# Altium schematic sheet MicroController.SchDoc: Teknofest Project
size 381 x 241 mm; Date: 21/12/2023; SheetNumber: 2; SheetTotal: 4; Prepared by: Mustafa Oğuz Ateş
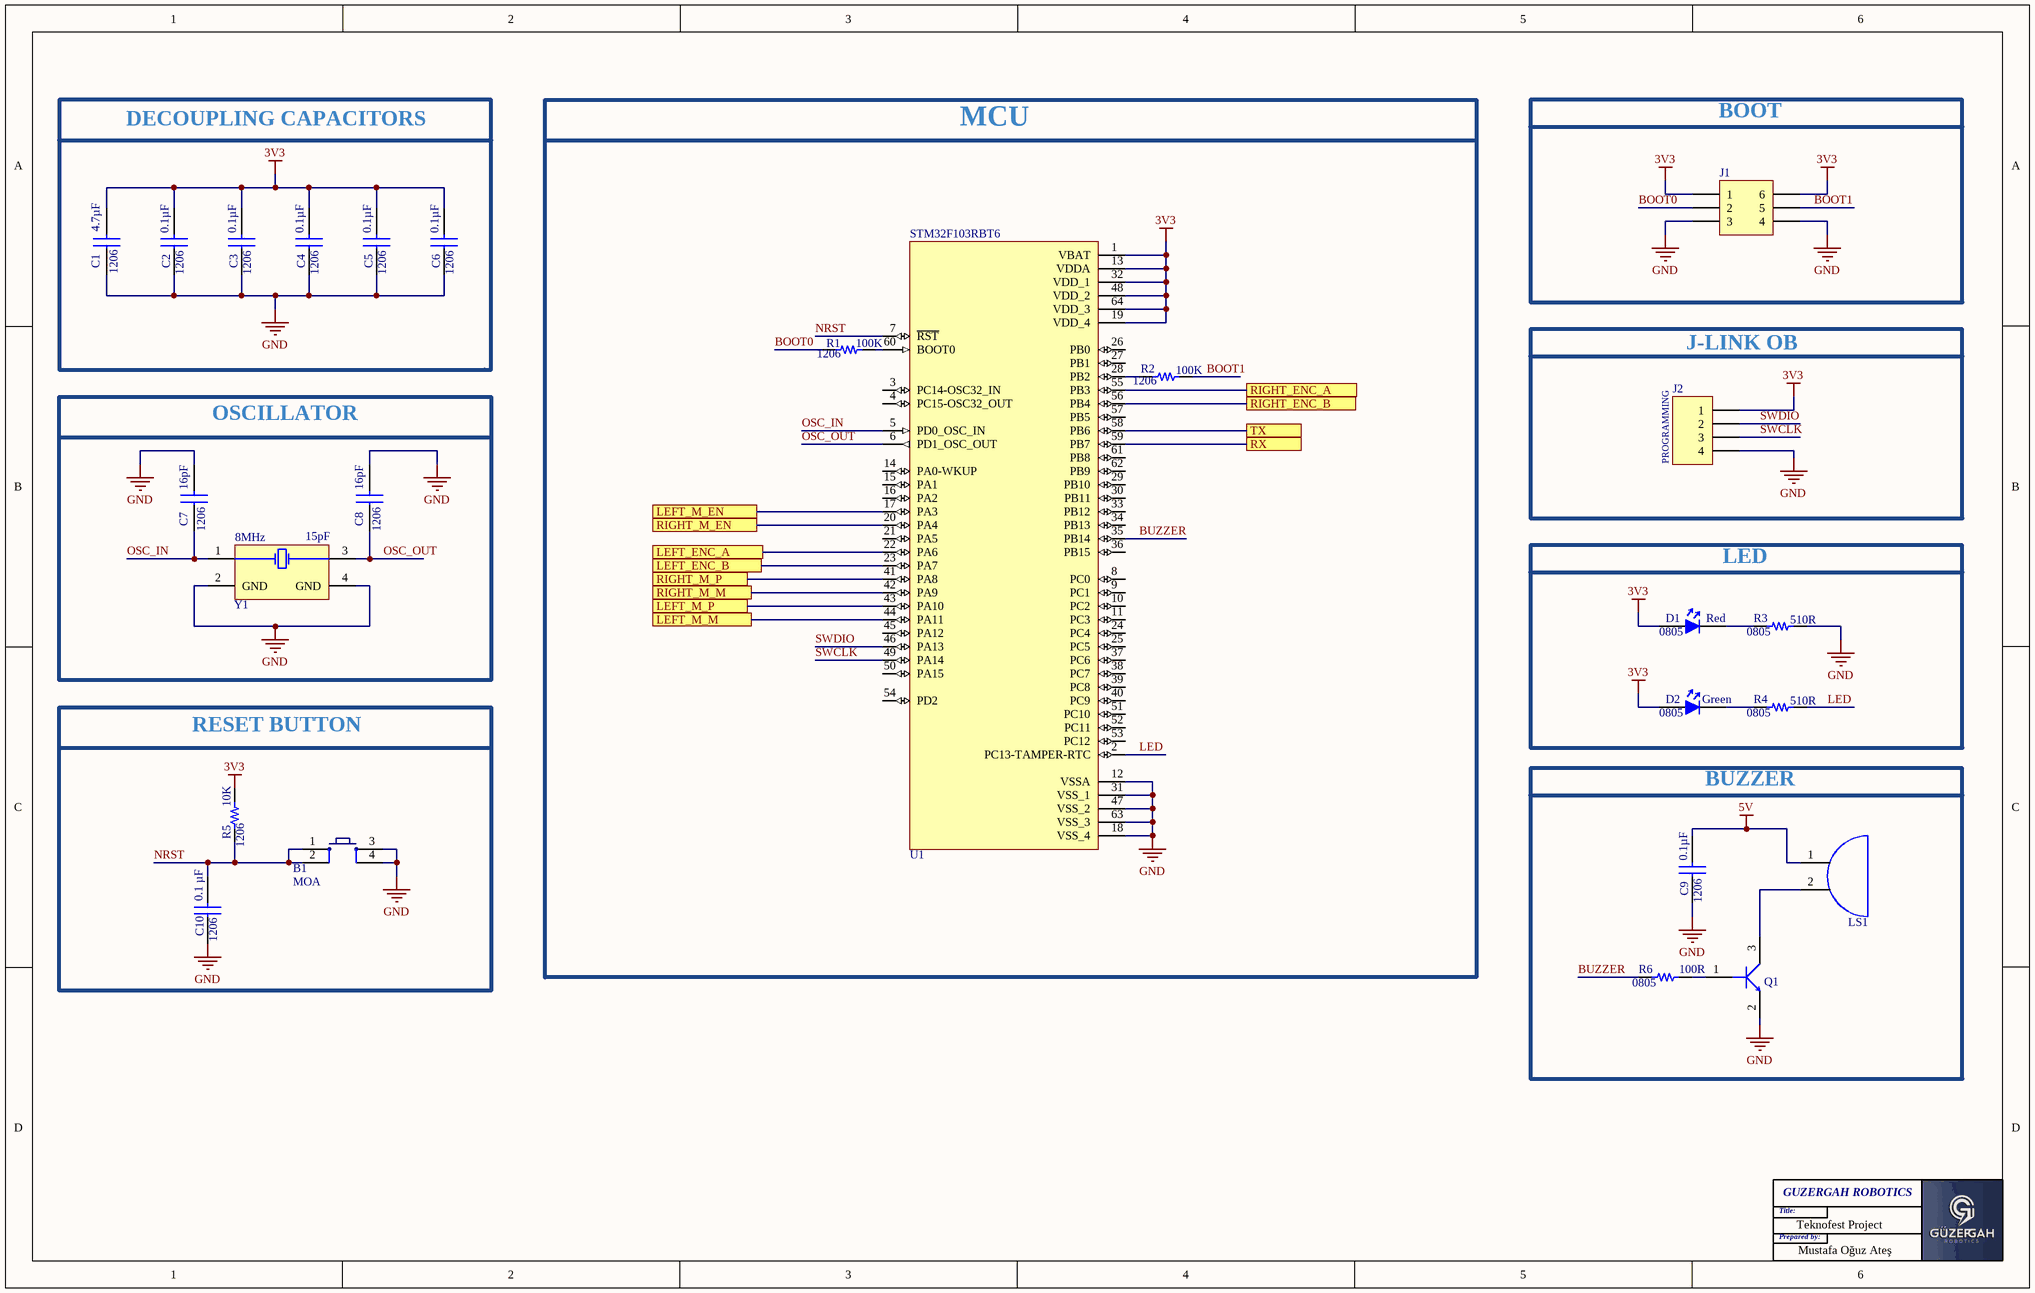
[diagram p0: MicroController.SchDoc]

## Parts
B1  Designed by: MOA  [PUSH BUTTON-SMD]  (hidden comment: Push Button)
C1  value 4.7µF  Package / Case: 1206  [CAP_1206_4.7uF]  (hidden comment: CAP CER 4.7 uF 1206)
C2  value 0.1µF  Package / Case: 1206  [CAP_1206_0.1uF]  (hidden comment: CAP_1206_0.1uF)
C3  value 0.1µF  Package / Case: 1206  [CAP_1206_0.1uF]  (hidden comment: CAP_1206_0.1uF)
C4  value 0.1µF  Package / Case: 1206  [CAP_1206_0.1uF]  (hidden comment: CAP_1206_0.1uF)
C5  value 0.1µF  Package / Case: 1206  [CAP_1206_0.1uF]  (hidden comment: CAP_1206_0.1uF)
C6  value 0.1µF  Package / Case: 1206  [CAP_1206_0.1uF]  (hidden comment: CAP_1206_0.1uF)
C7  value 16pF  Package / Case: 1206  [CAP_1206_16pF]  (hidden comment: CAP_1206_16pF)
C8  value 16pF  Package / Case: 1206  [CAP_1206_16pF]  (hidden comment: CAP_1206_16pF)
C9  value 0.1µF  Package / Case: 1206  [CAP_1206_0.1uF]  (hidden comment: CAP_1206_0.1uF)
C10  value 0.1 µF  Package / Case: 1206  [CAP_1206_0.1uF]  (hidden comment: CAP_1206_0.1uF)
D1  Package / Case: 0805  Illumination Color: Red  [LED_RED_0805]  (hidden comment: LED RED 0805)
D2  Package / Case: 0805  Color: Green  [LED_GREEN_0805]  (hidden comment: LED GREEN 0805)
J1  L-KLS1-208Y-5.0-2-06-W-8  [BOOT_HEADER_2.54MM_2X3PINS]  (value not drawn)
J2  DS1023-1X4S21  [J-LINK OB]  (value not drawn)
LS1  CMI-9605IC-0580T  [BUZZER]  (value not drawn)
Q1  MMBT3904-7-F  [SOT-23F]  (value not drawn)
R1  value 100K  Package / Case: 1206  [RES_1206_100K]  (hidden comment: RES_1206_10K)
R2  value 100K  Package / Case: 1206  [RES_1206_100K]  (hidden comment: RES_1206_10K)
R3  value 510R  Package / Case: 0805  [RES_0805_510R]  (hidden comment: RES_0805_510R)
R4  value 510R  Package / Case: 0805  [RES_0805_510R]  (hidden comment: RES_0805_510R)
R5  value 10K  Package / Case: 1206  [RES_1206_10k]  (hidden comment: RES_1206_10K)
R6  value 100R  Package / Case: 0805  [RES_0805_100R]  (hidden comment: RES_0805_100R)
U1  STM32F103RBT6  [LQFP-64]
Y1  Frequency: 8MHz  Capacitance: 15pF  [8MHz-OSC]  (hidden comment: ECS-2033-080-AU)

## Blocks framed on the sheet
DECOUPLING CAPACITORS: C1-C6
BOOT: J1
MCU: R1 R2 U1
J-LINK OB: J2
LED: D1 D2 R3 R4
BUZZER: C9 LS1 Q1 R6

## Ports
LEFT_ENC_A, LEFT_ENC_B, LEFT_M_EN, LEFT_M_M, LEFT_M_P, RIGHT_ENC_A, RIGHT_ENC_B, RIGHT_M_EN, RIGHT_M_M, RIGHT_M_P, RX, TX

## Nets
3V3: C1.2 C2.2 C3.2 C4.2 C5.2 C6.2 D1.2 D2.2 J1.1 J1.6 J2.1 R5.2 U1.1(VBAT) U1.13(VDDA) U1.19(VDD_4) U1.32(VDD_1) U1.48(VDD_2) U1.64(VDD_3)
5V: C9.2 LS1.1
GND: B1.3 B1.4 C1.1 C2.1 C3.1 C4.1 C5.1 C6.1 C7.2 C8.2 C9.1 C10.1 J1.3 J1.4 J2.4 Q1.2(E) R3.2 U1.12(VSSA) U1.18(VSS_4) U1.31(VSS_1) U1.47(VSS_2) U1.63(VSS_3) Y1.2(GND) Y1.4(GND)
BOOT0: J1.2 R1.1
BOOT1: J1.5 R2.2
BUZZER: R6.1 U1.35(PB14)
LED: R4.2 U1.2(PC13-TAMPER-RTC)
LEFT_ENC_A: U1.22(PA6) ; port LEFT_ENC_A
LEFT_ENC_B: U1.23(PA7) ; port LEFT_ENC_B
LEFT_M_EN: U1.17(PA3) ; port LEFT_M_EN
LEFT_M_M: U1.44(PA11) ; port LEFT_M_M
LEFT_M_P: U1.43(PA10) ; port LEFT_M_P
NRST: B1.1 B1.2 C10.2 R5.1 U1.7(~{RST})
OSC_IN: C7.1 U1.5(PD0_OSC_IN) Y1.1(Tristate)
OSC_OUT: C8.1 U1.6(PD1_OSC_OUT) Y1.3(OUT)
RIGHT_ENC_A: U1.55(PB3) ; port RIGHT_ENC_A
RIGHT_ENC_B: U1.56(PB4) ; port RIGHT_ENC_B
RIGHT_M_EN: U1.20(PA4) ; port RIGHT_M_EN
RIGHT_M_M: U1.42(PA9) ; port RIGHT_M_M
RIGHT_M_P: U1.41(PA8) ; port RIGHT_M_P
RX: U1.59(PB7) ; port RX
SWCLK: J2.3 U1.49(PA14)
SWDIO: J2.2 U1.46(PA13)
TX: U1.58(PB6) ; port TX
NetD1_1: D1.1 R3.1
NetD2_1: D2.1 R4.1
NetLS1_2: LS1.2 Q1.3(C)
NetQ1_1: Q1.1(B) R6.2
NetR1_2: R1.2 U1.60(BOOT0)
NetR2_1: R2.1 U1.28(PB2)

Not connected (* = marked no-connect by the designer): U1 3(PC14-OSC32_IN) 4(PC15-OSC32_OUT) 8(PC0) 9(PC1) 10(PC2) 11(PC3) 14(PA0-WKUP) 15(PA1) 16(PA2) 21(PA5) 24(PC4) 25(PC5) 26(PB0) 27(PB1) 29(PB10) 30(PB11) 33(PB12) 34(PB13) 36(PB15) 37(PC6) 38(PC7) 39(PC8) 40(PC9) 45(PA12) 50(PA15) 51(PC10) 52(PC11) 53(PC12) 54(PD2) 57(PB5) 61(PB8) 62(PB9)

## Notes on the sheet
- OSCILLATOR
- (near J2) PROGRAMMING
- RESET BUTTON
- Title:
- Prepared by:
- GUZERGAH ROBOTICS

## Library data of the parts
B1 = Push Button: KOMPONENT SEÇİLMEDİ SMD Push Button; Satın Alma Linki: https://urun.n11.com/diger/mini-pushbutton-switch-smd-P227461537?gclid=Cj0KCQjwkoDmBRCcARIsAG3xzl8Y_-jeD7HocNM6lvuZ_rVp83568XPGtNzlPwXWLph8oCRqo0yh87UaApZYEALw_wcB&gclsrc=aw.ds
C1 = CAP_1206_4.7uF
C2-C6 C9 C10 = CAP_1206_0.1uF: CAP CER 0.1 uF 1206
C7 C8 = CAP_1206_16pF: CAP CER 16pF 1206
D1 = LED RED 0805: KOMPONENT SEÇİLMEDİ; Manufacturer: Osram Opto; Manufacturer Part Number: LH R974-LP-1; Lens Color: White; Forward Voltage: 1.8V; Lens Style: Diffused,Flat,Colorless; Luminous Intensity: 71mcd; Viewing Angle: 160°; Forward Current: 30mA; Dominant Wavelength: 645nm; Number of Elements: 1; Test Current: 20mA; Reverse Voltage: 5V; Lens Transparency: Diffused; Luminous Flux: 0.17lm; Lens Size: 1.25mm; Designed by: Mustafa; Supplier 1: Digi-Key; RoHS: Yes; Category: LEDs; Stock 1: 35632; Pricing 1: 1=0,26000, 10=0,13900, 100=0,06480, 500=0,05978, 1000=0,04683, 2000=0,04584 (USD); Mount: Surface Mount; Number of Pins: 2; Color: Red; Case Code (Imperial): 0805; Case Code (Metric): 2012; Min Operating Temperature: -30°C; Max Operating Temperature: 85°C; Packaging: Tape and Reel; Package Quantity: 1; Series: CHipLED; Length: 2.1mm; Width: 1.25mm; Depth: 1.35mm; Radiation Hardening: No; RoHS Compliant: Yes; ComponentLink1URL: http://www.jameco.com/Jameco/Products/ProdDS/2085634.pdf?src-supplier=Jameco; ComponentLink1Description: http://www.jameco.com/Jameco/Products/ProdDS/2085634.pdf?src-supplier=Jameco; ComponentLink2URL: http://components.arrow.com/part/dataview/0323_01825492?src-supplier=Arrow+Europe; ComponentLink2Description: http://components.arrow.com/part/dataview/0323_01825492?src-supplier=Arrow+Europe; ComponentLink3URL: https://dammedia.osram.info/media/resource/hires/osram-dam-2493888/LH%20R974.pdf?src-supplier=Digi-Key; ComponentLink3Description: https://dammedia.osram.info/media/resource/hires/osram-dam-2493888/LH%20R974.pdf?src-supplier=Digi-Key; ComponentLink4URL: http://www.mouser.com/ds/2/311/LH%20R974%20-%20CHIPLED%200805-318659.pdf?src-supplier=Mouser; ComponentLink4Description: http://www.mouser.com/ds/2/311/LH%20R974%20-%20CHIPLED%200805-318659.pdf?src-supplier=Mouser; ComponentLink5URL: https://www.verical.com/server-webapp/html/getDatasheet?partID=258950&src-supplier=Verical; ComponentLink5Description: https://www.verical.com/server-webapp/html/getDatasheet?partID=258950&src-supplier=Verical; ComponentLink6URL: http://components.arrow.com/part/dataview/41971690S1077610N9133?src-supplier=Arrow+Electronics; ComponentLink6Description: http://components.arrow.com/part/dataview/41971690S1077610N9133?src-supplier=Arrow+Electronics; ComponentLink7URL: http://components.arrow.com/part/dataview/41971690S6190115N2128?src-supplier=Arrow+Electronics; ComponentLink7Description: http://components.arrow.com/part/dataview/41971690S6190115N2128?src-supplier=Arrow+Electronics; Supplier Part Number 1: 475-1415-1-ND
D2 = LED GREEN 0805: KOMPONENT SEÇİLMEDİ; Manufacturer: Vishay Lite-On; Manufacturer Part Number: LTST-C171GKT; Designed by: Mustafa; Lens Color: Colorless; Viewing Angle: 130°; Lens Style: Diffused,Colorless,Rectangular,Clear; Luminous Intensity: 12mcd; Forward Current: 30mA; Forward Voltage: 2.1V; Power Rating: 100mW; Dominant Wavelength: 569nm; Test Current: 10mA; Lens Transparency: Clear; Number of Elements: 1; Wavelength: 585nm; Reverse Voltage: 5V; Supplier 1: Digi-Key; RoHS: Yes; Category: LEDs; Stock 1: 159023; Pricing 1: 1=0,26000, 10=0,14100, 100=0,06560, 500=0,06060, 1000=0,04747 (USD); Mount: Surface Mount; Number of Pins: 2; Case Code (Metric): 2012; Case Code (Imperial): 0805; Min Operating Temperature: -55°C; Max Operating Temperature: 85°C; Package Quantity: 1; Packaging: Tape and Reel; Illumination Color: Green; Power Dissipation: 100mW; Number of LEDs: 1; Series: CHIPLED 0805; Length: 2mm; Width: 1.25mm; Height: 0.8mm; Depth: 1.25mm; Radiation Hardening: No; Lead Free: Lead Free; RoHS Compliant: Yes; ComponentLink1URL: https://datasheet.ciiva.com/2110/ltst-c171gkt-2110000.pdf?src-supplier=Digi-Key; ComponentLink1Description: https://datasheet.ciiva.com/2110/ltst-c171gkt-2110000.pdf?src-supplier=Digi-Key; ComponentLink2URL: https://datasheet.ciiva.com/11773/0900766b80dc0296-11773991.pdf?src-supplier=RSComponents; ComponentLink2Description: https://datasheet.ciiva.com/11773/0900766b80dc0296-11773991.pdf?src-supplier=RSComponents; ComponentLink3URL: https://datasheet.ciiva.com/12400/lite-on-ltst-c171gkt-190133-12400647.pdf?src-supplier=Mouser; ComponentLink3Description: https://datasheet.ciiva.com/12400/lite-on-ltst-c171gkt-190133-12400647.pdf?src-supplier=Mouser; ComponentLink4URL: https://datasheet.ciiva.com/2110/ltst-c171gkt-2110001.pdf?src-supplier=Digi-Key; ComponentLink4Description: https://datasheet.ciiva.com/2110/ltst-c171gkt-2110001.pdf?src-supplier=Digi-Key; ComponentLink5URL: https://datasheet.ciiva.com/2110/ltst-c171gkt-2110002.pdf?src-supplier=Digi-Key; ComponentLink5Description: https://datasheet.ciiva.com/2110/ltst-c171gkt-2110002.pdf?src-supplier=Digi-Key; ComponentLink6URL: https://datasheet.ciiva.com/16396/ltst-c171gkt-16396549.pdf?src-supplier=Future+Electronics; ComponentLink6Description: https://datasheet.ciiva.com/16396/ltst-c171gkt-16396549.pdf?src-supplier=Future+Electronics; Supplier Part Number 1: 160-1423-1-ND
J1 = BOOT_HEADER: FEMALE HEADER 6PIN(2X3) 2.54MM THT V/T 8x7.62 TUBE; ComponentLink1Description: New link; ComponentLink1URL: https://ozdisan.com/Product/Detail/652771/L-KLS1-208Y-5-0-2-06-W-8
J2 = J-LINK OB: FEMALE HEADER 4PIN(1x4) 2.54mm THT V/T TRAY; ComponentLink1Description: New link; ComponentLink1URL: https://ozdisan.com/konnektor-ve-baglanti-elemanlari/header-konnektorler/disi-headerlar/DS1023-1X4S21/353863
LS1 = BUZZER: Audio Buzzer Magnetic 3VDC 7VDC 30mA 5VDC 85dB 2600Hz to 2800Hz Through Hole Pin Box; Manufacturer: CUI Devices; Designed by: MOA; Supplier: Digi-Key; Supplier Part Number: 2223-CMI-9605IC-0580T-ND; Manufacturer Part Number: CMI-9605IC-0580T; RoHS: No; Category: Audio Products; Stock: 5910; Pricing: 1=1,22, 10=1,014, 25=0,938, 50=0,883, 100=0,8298, 250=0,76976, 500=0,71396, 1000=0,66741, 5000=0,65403 (USD); Case/Package: CMI-9605IC
Q1 = BJT_NPN_TRANSISTOR: MMBT3904-7-F - TRANSISTOR DIS.200mA 40V NPN SOT23 SMT/ ÖZDİSAN; Manufacturer: Diodes Zetex; Designed by: MOA; Max Power Dissipation: 300mW; Max Collector Current: 200mA; Collector Base Voltage (VCBO): 60V; Frequency: 300MHz; hFE Min: 100; Number of Elements: 1; Emitter Base Voltage (VEBO): 6V; Collector Emitter Saturation Voltage: 300mV; Power Dissipation: 350mW; Element Configuration: Single; Manufacturer Part Number: MMBT3904-7-F; RoHS: Yes; Category: BJTs; Stock 1: 2393281; Pricing 1: 1=0,12000, 10=0,08600, 25=0,08280, 100=0,04660, 500=0,03664, 1000=0,02544 (USD); Mount: Surface Mount; Case/Package: SOT-23; Number of Pins: 3; Weight: 0.000282oz; Contact Plating: Tin,Matte; Min Operating Temperature: -55°C; Max Operating Temperature: 150°C; Collector Emitter Voltage (VCEO): 40V; Polarity: NPN; Packaging: Tape and Reel; Package Quantity: 3000; Transition Frequency: 300MHz; Collector Emitter Breakdown Voltage: 40V; Max Breakdown Voltage: 40V; Continuous Collector Current: 200mA; Max Frequency: 300MHz; Gain Bandwidth Product: 300MHz; Series: -; Collector-emitter Voltage-Max: 300mV; Voltage Rating (DC): 40V; Length: 3.05mm; Width: 1.4mm; Height: 1mm; Radiation Hardening: No; REACH SVHC: No SVHC; Lead Free: Lead Free; RoHS Compliant: Yes; ComponentLink1URL: https://datasheet.ciiva.com/11201/ds30036-11201778.pdf?src-supplier=Avnet; ComponentLink1Description: https://datasheet.ciiva.com/11201/ds30036-11201778.pdf?src-supplier=Avnet; Supplier Part Number 1: MMBT3904-FDIDKR-ND; ComponentLink7Description: New link; ComponentLink7URL: https://ozdisan.com/Product/Detail/609899/MMBT3904-7-F
R1 R2 = RES_1206_100K: RES 1206 100K ohm
R3 R4 = RES_0805_510R: RES 0805 510 ohm
R5 = RES_1206_10K: RES 1206 10K ohm
R6 = RES_0805_100R: RES 0805 100 ohm
U1 = STM32F103RBT6: STM32F103RTB6 LQFP-64; MF: STMicroelectronics; Designed by: MOA; Package: LQFP-64 STMicroelectronics; Price: None; Check_prices: https://www.snapeda.com/parts/STM32F103RBT6/STMicroelectronics/view-part/?ref=eda; Value: *; SnapEDA_Link: https://www.snapeda.com/parts/STM32F103RBT6/STMicroelectronics/view-part/?ref=snap; MP: STM32F103RBT6; Availability: In Stock; Purchase-URL: https://pricing.snapeda.com/search?q=STM32F103RBT6&ref=eda
Y1 = OSI_8MHz_15pF: CRYSTAL OSCILLATOR XO 8.0000MHZ CMOS SMD; Designed by: MOA; ComponentLink1Description: New link; ComponentLink1URL: https://ozdisan.com/pasif-komponentler/kristaller-osilatorler-ve-rezanatorler/osilatorler/ECS-2033-080-AU/994835